# Altium schematic sheet CAN Schematic.SchDoc
size A
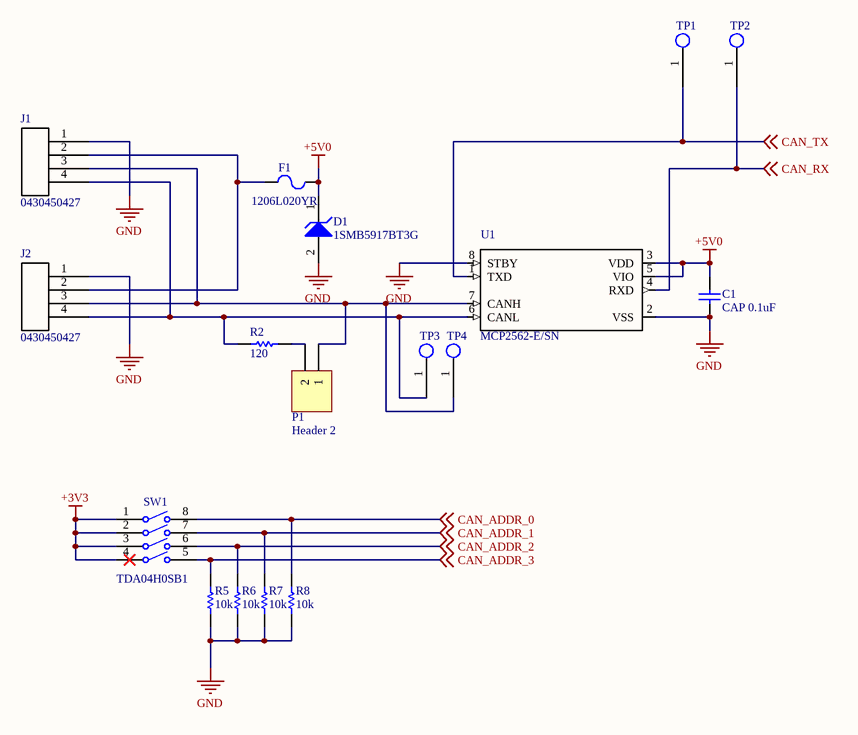
[diagram p0: CAN Schematic.SchDoc]

## Parts
C1  CAP 0.1uF  [CAPC0805(2012)75_L]
D1  1SMB5917BT3G  [ONSC-SMB-2-403A-03_H_V]
F1  1206L020YR  [LFUS-1206L020YR_V]
J1  0430450427  [0430450427]
J2  0430450427  [0430450427]
P1  Header 2  [HDR1X2]
R2  120  [RESC2013X70X40LL20T20]
R5  10k  [RESC2013X70X40LL20T20]
R6  10k  [RESC2013X70X40LL20T20]
R7  10k  [RESC2013X70X40LL20T20]
R8  10k  [RESC2013X70X40LL20T20]
SW1  TDA04H0SB1  [CKCP-TDA04H0SB1R_V]
TP1  Test Point  [Test Point Through-hole]  (value not drawn)
TP2  Test Point  [Test Point Through-hole]  (value not drawn)
TP3  Test Point  [Test Point Through-hole]  (value not drawn)
TP4  Test Point  [Test Point Through-hole]  (value not drawn)
U1  MCP2562-E/SN  [SOIC127P600X175-8N]

## Nets
+3V3: SW1.1 SW1.2 SW1.3 SW1.4
+5V0: C1.2 D1.1(K) F1.2 U1.3(VDD) U1.5(VIO)
GND: C1.1 D1.2(A) J1.1 J2.1 R5.2 R6.2 R7.2 R8.2 U1.2(VSS) U1.8(STBY)
CAN_ADDR_0: R8.1 SW1.8 ; off-sheet CAN_ADDR_0
CAN_ADDR_1: R7.1 SW1.7 ; off-sheet CAN_ADDR_1
CAN_ADDR_2: R6.1 SW1.6 ; off-sheet CAN_ADDR_2
CAN_ADDR_3: R5.1 SW1.5 ; off-sheet CAN_ADDR_3
CAN_RX: TP2.1 U1.4(RXD) ; off-sheet CAN_RX
CAN_TX: TP1.1 U1.1(TXD) ; off-sheet CAN_TX
NetF1_1: F1.1 J1.2 J2.2
NetJ1_3: J1.3 J2.3 P1.1 TP4.1 U1.7(CANH)
NetJ1_4: J1.4 J2.4 R2.2 TP3.1 U1.6(CANL)
NetP1_2: P1.2 R2.1

## Notes on the sheet
- Title
- Size:
- Date:
- A
- Number:
- Time:
- Revision:
- Sheet
- of
- File:

## Library data of the parts
C1 = CMP-1036-00339-1: CAP 2.7pF 50V ±0.1pF 0805 (2012 Metric) Thickness 0.75mm SMD; Case-EIA: 0805; Case-Metric: 2012; Tolerance: Â±0.1pF; Rated Voltage: 50 V; Value: 2.7pF; Max Thickness: 0.75 mm; Technology: SMT
D1 = CMP-1060-00195-1: 3 W Zener Voltage Regulator, 2-Pin SMB, Pb-Free, Tape and Reel; Manufacturer: On Semiconductor; VZ Typ (V): 4.7; RoHS: Pb-Free; ComponentLink1Description: Manufacturer URL; ComponentLink2URL: http://www.onsemi.com/pub_link/Collateral/1SMB5913BT3-D.PDF; Mounting Technology: Surface Mount; PackageVersion: Rev. H, 05/2011; DatasheetVersion: Rev. 8; Packing: Tape and Reel; PartNumber: 1SMB5917BT3G; ComponentLink2Description: Datasheet; ComponentLink3Description: Package Specification; PackageReference: SMB-2-403A-03_H; ComponentLink1URL: http://www.onsemi.com/; PackageDescription: 2-Pin Small Molded Package, J-Bend Lead, Body 4.33 x 3.625 mm; ComponentLink3URL: http://www.onsemi.com/pub_link/Collateral/1SMB5913BT3-D.PDF
F1 = CMP-2000-05472-1: PTC Resettable Fuse, 100 A, 0.6W, -40 to 85 degC, 2-Pin SMD, RoHS, Tape and Reel; Manufacturer: Littelfuse; Hold Current [Ih]: 0.2A; Working Voltage-Max: 24V; Trip Current: 0.42A; Operating Temp Range: -40to+85°C; Size: 1206; Manufacturer URL: http://www.littelfuse.com/; Datasheet Version: 02/2015; Mounting Technology: SurfaceMount; Datasheet URL: http://download.siliconexpert.com/pdfs/2015/4/10/21/0/43/983/ltf_/manual/3609284120511713636092822459449496littelfuse_ptc_1206l_datasheet.pdf.pdf.pdf; Package Description: 2-Pin Surface Mount Device, Body 3.2 x 1.65 mm; Package Reference: 1206L020YR
J1 J2 = 0430450427-Single row schematic: Molex micro-fit 3.0 dual row header. P/N 0430450427
P1 = Header 2: Header, 2-Pin; LatestRevisionDate: 17-Jul-2002; LatestRevisionNote: Re-released for DXP Platform.; Publisher: Altium Limited
R2 R5-R8 = CMP-2001-04440-2: RES SMD 150K OHM 1% 1/8W 0805; Manufacturer: Panasonic; Part Number: ERJ-6ENF1503V; Datasheet: http://industrial.panasonic.com/cdbs/www-data/pdf/RDA0000/AOA0000C86.pdf
SW1 = SMD Half-Pitch Dip Switch Array: Ultra-Miniature Surface Mount Half-Pitch DIP Switch, 25 mA, 24 V, -40 to 85 degC, 8-Pin SMD, RoHS, Tube; Contact Current Rating: 100 mA; Throw Configuration: SPST; Voltage Rating (DC): 24 V; Max Contact Resistance: 100 mohm; Max Current Rating: 25 mA; REACH SVHC: No SVHC; DatasheetVersion: 02/2016; Case\Package: DIP; Package Quantity: 70; Lead Pitch: 1.27 mm; Contact Plating: Gold; Packaging: Rail/Tube; Contact Finish: Gold; Mount: Surface Mount; Height: 2.3 mm; Contact Material: Copper; Max Operating Temperature: 85 degC; Max Voltage Rating (DC): 24 V; ComponentLink1URL: http://www.ck-components.com/media/1328/tda.pdf; PackageDescription: 8-Pin Surface Mount Device, Body 6.21 x 6.2 mm, Pitch 1.27 mm; Radiation Hardening: No; ComponentLink1Description: Datasheet; Current Rating: 100 mA; RoHSCompliant: true; PackageReference: TDA04H0SB1R; Min Operating Temperature: -40 degC; Pins: 4; Mounting Technology: Surface Mount; Length: 6.21 mm
U1 = MCP2562-E/SN: Microchip MCP2562-E/SN, CAN Transceiver 1MBps 1-channel IEC 61000-4-2, 8-Pin SOIC; Price: None; MF: Microchip; SnapEDA_Link: https://www.snapeda.com/parts/MCP2562-E/SN/Microchip/view-part/?ref=snap; MP: MCP2562-E/SN; Availability: Unavailable; Package: SO-8 Microchip; Value: *